# EAGLE design Overdrive (EAGLE 7.7.0)
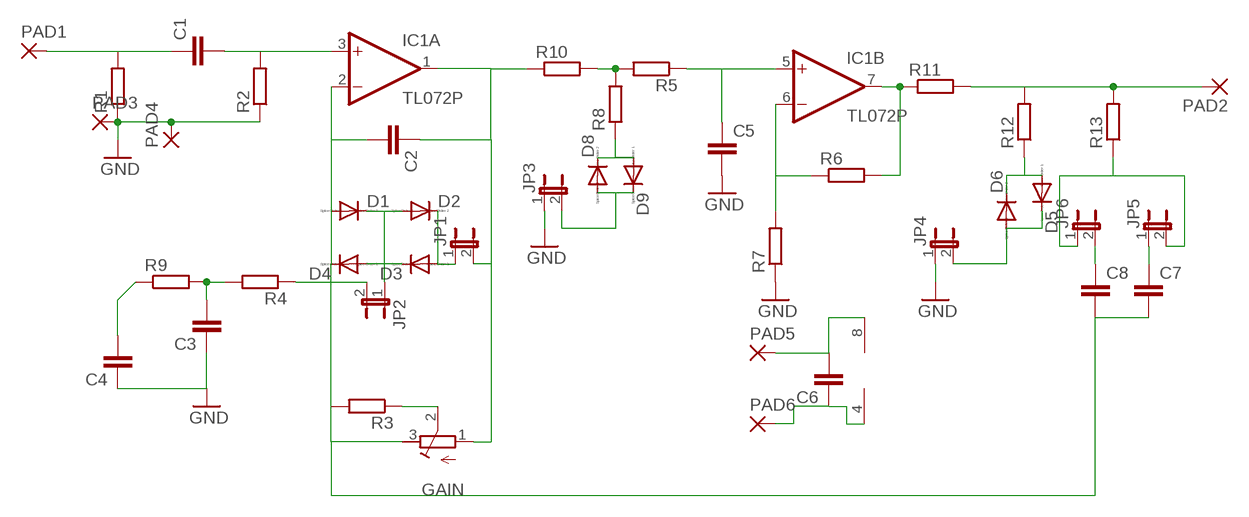
[diagram p0: schematic, sheet 1]

## Parts
C1  C-EU050-030X075  [C050-030X075]
C2  C-EU050-030X075  [C050-030X075]
C3  C-EU050-030X075  [C050-030X075]
C4  C-EU050-030X075  [C050-030X075]
C5  C-EU050-030X075  [C050-030X075]
C6  C-EU050-030X075  [C050-030X075]
C7  C-EU050-030X075  [C050-030X075]
C8  C-EU050-030X075  [C050-030X075]
D1  1N4148DO35-7  [DO35-7]
D2  1N4148DO35-7  [DO35-7]
D3  1N4148DO35-7  [DO35-7]
D4  1N4148DO35-7  [DO35-7]
D5  1N4148DO35-7  [DO35-7]
D6  1N4148DO35-7  [DO35-7]
D8  1N4148DO35-7  [DO35-7]
D9  1N4148DO35-7  [DO35-7]
GAIN  R-TRIMM64W  [RTRIM64W]
IC1  TL072P  [DIL08]
JP1  JP1E  [JP1]
JP2  JP1E  [JP1]
JP3  JP1E  [JP1]
JP4  JP1E  [JP1]
JP5  JP1E  [JP1]
JP6  JP1E  [JP1]
PAD1  WIREPAD2,54/0,8  [2,54/0,8]
PAD2  WIREPAD2,54/0,8  [2,54/0,8]
PAD3  WIREPAD2,54/0,8  [2,54/0,8]
PAD4  WIREPAD2,54/0,8  [2,54/0,8]
PAD5  WIREPAD2,54/0,8  [2,54/0,8]
PAD6  WIREPAD2,54/0,8  [2,54/0,8]
R1  R-EU_0207/7  [0207/7]
R2  R-EU_0207/7  [0207/7]
R3  R-EU_0207/7  [0207/7]
R4  R-EU_0207/7  [0207/7]
R5  R-EU_0207/7  [0207/7]
R6  R-EU_0207/7  [0207/7]
R7  R-EU_0207/7  [0207/7]
R8  R-EU_0207/7  [0207/7]
R9  R-EU_0207/7  [0207/7]
R10  R-EU_0207/7  [0207/7]
R11  R-EU_0207/7  [0207/7]
R12  R-EU_0207/7  [0207/7]
R13  R-EU_0207/7  [0207/7]

## Nets
GND: C3.1 C4.1 C5.2 JP3.1 JP4.1 PAD3.1(P) PAD4.1(P) R1.1 R2.1 R7.1
N$1: C1.1 PAD1.1(P) R1.2
N$2: C1.2 IC1.3(A:+IN) R2.2
N$3: C2.2 C7.2 C8.2 D1.A D4.C GAIN.3(E) IC1.2(A:-IN) JP2.2 R3.2 R4.1
N$4: C2.1 GAIN.1(A) IC1.1(A:OUT) JP1.2 R10.1
N$5: IC1.6(B:-IN) R6.1 R7.2
N$6: IC1.7(B:OUT) R6.2 R11.1
N$7: D1.C D2.A D3.C D4.A JP2.1
N$8: D8.A D9.C JP3.2
N$9: D2.C D3.A JP1.1
N$10: GAIN.2(S) R3.1
N$11: C6.2 IC1.8(P:V+) PAD5.1(P)
N$12: D8.C D9.A R8.1
N$13: C4.2 R9.1
N$14: C3.2 R4.2 R9.2
N$15: R5.2 R8.2 R10.2
N$16: C6.1 IC1.4(P:V-) PAD6.1(P)
N$17: C5.1 IC1.5(B:+IN) R5.1
N$18: PAD2.1(P) R11.2 R12.2 R13.2
N$19: D5.A D6.C R12.1
N$20: D5.C D6.A JP4.2
N$21: C8.1 JP6.2
N$22: JP5.2 JP6.1 R13.1
N$23: C7.1 JP5.1

## Library data of the parts
C1-C8 = rcl:C-EU: CAPACITOR, European symbol
D1-D6 D8 D9 = diode:1N4148: DIODE high speed (Philips)
GAIN = rcl:R-TRIMM: Trimm resistor
IC1 = linear:TL072: OP AMP
JP1-JP6 = jumper:JP1E: JUMPER
PAD1-PAD6 = wirepad:WIREPAD: Wire PAD connect wire on PCB
R1-R13 = rcl:R-EU_: RESISTOR, European symbol

## Board
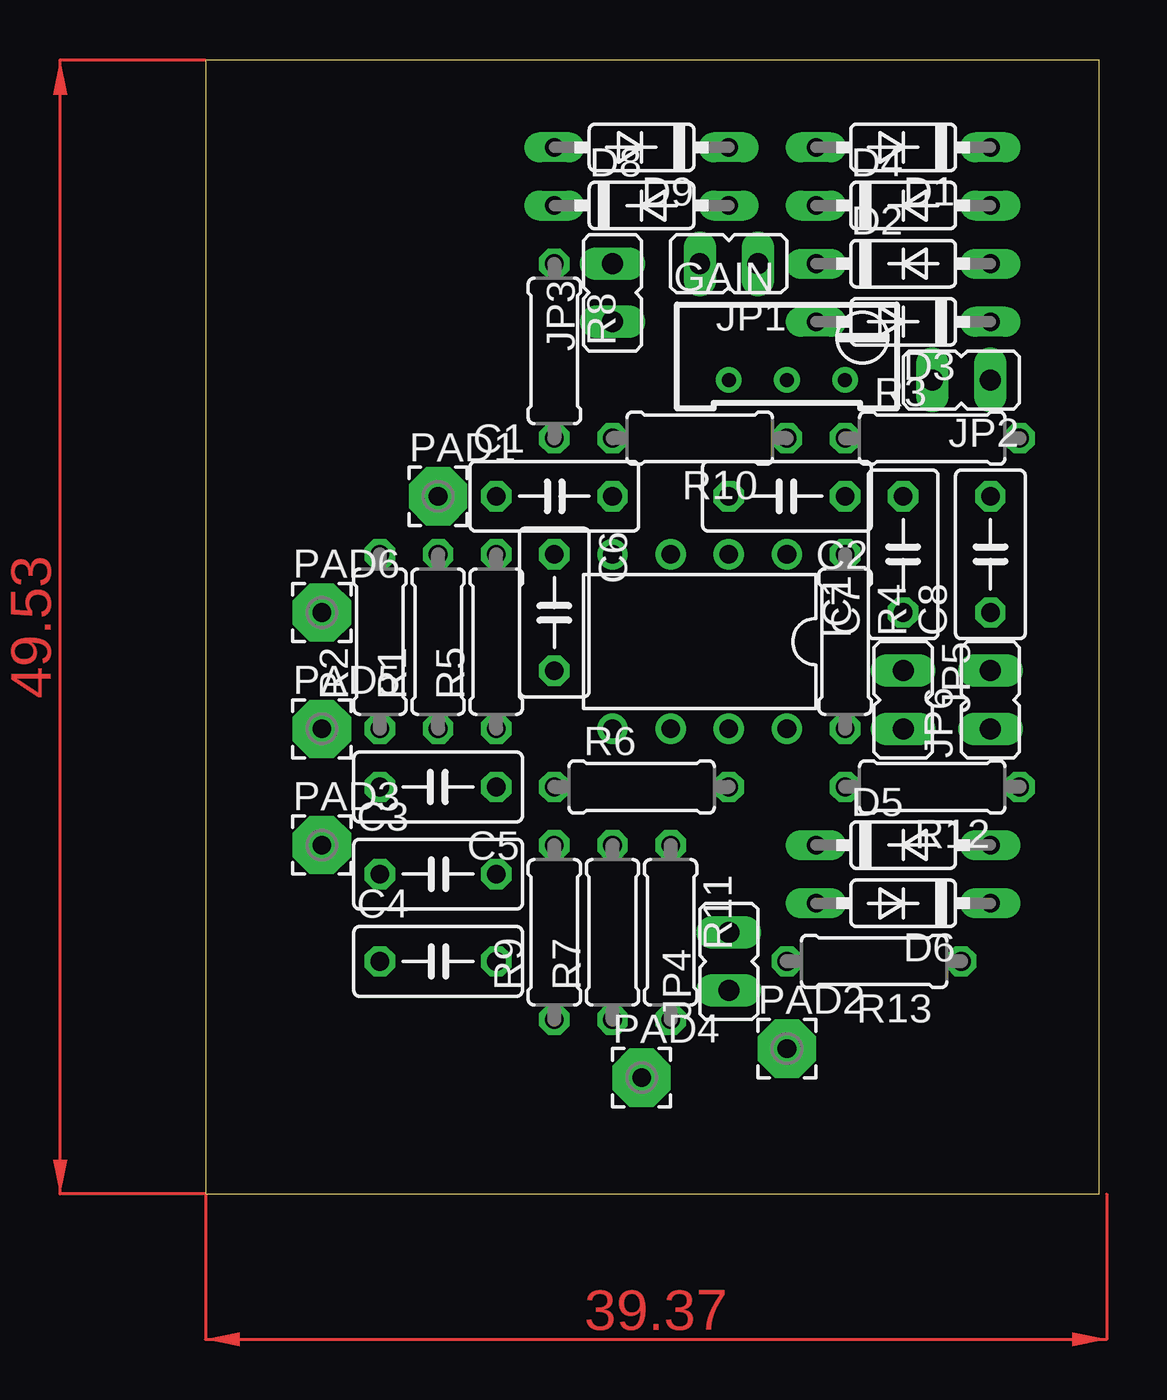
[diagram p1: board, top side]
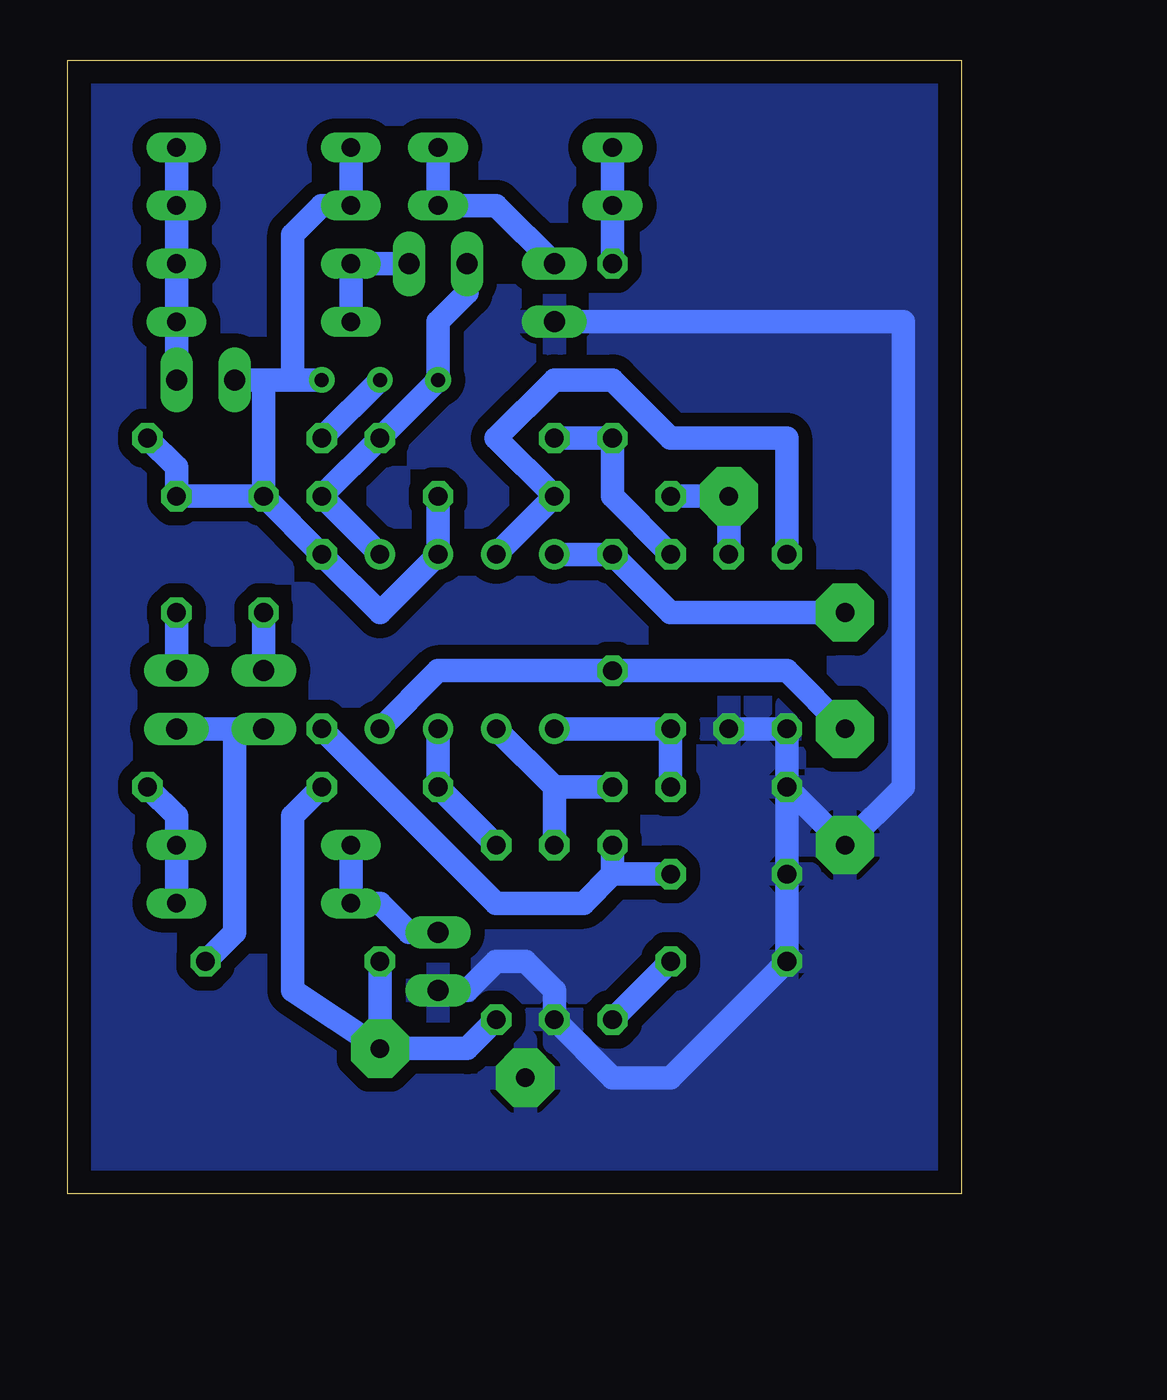
[diagram p2: board, bottom side, seen from below]

Size 39.04 x 49.52 mm. Coordinates in mm from the lower left corner, seen from the top.
Outline: 0,0 39.04,0 39.04,49.52 0,49.52 0,0
Copper layers (1*16): Top 0.035mm / dielectric 1.5mm / Bottom 0.035mm
Design rules "default": minimum track width 10mil, minimum drill 24mil, track to track 8mil, track to pad 8mil, pad to pad 8mil, via to via 8mil, smd to smd 8mil, copper to edge 40mil, drill to drill 8mil, minimum pad ring 10mil, minimum via ring 8mil, stop-mask expansion 4mil, vias tented up to drill 0mil, thermal gap 10mil

### Footprints (pad centres in the part's own frame; a part is rotated, then mirrored left to right if it is on the bottom)
C050-030X075 = drill 0.813 octagon: 1 -2.54,0; 2 2.54,0
DO35-7 = drill 0.813 long: A 3.81,0; C -3.81,0
RTRIM64W = drill 0.61: 1 1.27,-2.54; 2 1.27,0; 3 1.27,2.54
DIL08 = drill 0.813 pad 1.27: 1 -3.81,-3.81; 2 -1.27,-3.81; 3 1.27,-3.81; 4 3.81,-3.81; 5 3.81,3.81; 6 1.27,3.81; 7 -1.27,3.81; 8 -3.81,3.81
JP1 = drill 0.914 long: 1 0,-1.27; 2 0,1.27
2,54/0,8 = drill 0.813 pad 2.54 octagon: 1 0,0
0207/7 = drill 0.813 octagon: 1 -3.81,0; 2 3.81,0

### Placement (x,y rotation side)
C1  15.24,30.48 0 top
C2  25.4,30.48 180 top
C3  10.16,13.97 0 top
C4  10.16,10.16 0 top
C5  10.16,17.78 180 top
C6  15.24,25.4 270 top
C7  30.48,27.94 90 top
C8  34.29,27.94 90 top
D1  30.48,45.72 180 top
D2  30.48,40.64 0 top
D3  30.48,38.1 180 top
D4  30.48,43.18 0 top
D5  30.48,15.24 0 top
D6  30.48,12.7 180 top
D8  19.05,43.18 0 top
D9  19.05,45.72 180 top
GAIN  25.4,36.83 270 top
IC1  21.59,24.13 180 top
JP1  22.86,40.64 90 top
JP2  33.02,35.56 90 top
JP3  17.78,39.37 0 top
JP4  22.86,10.16 0 top
JP5  30.48,21.59 180 top
JP6  34.29,21.59 0 top
PAD1  10.16,30.48 0 top
PAD2  25.4,6.35 0 top
PAD3  5.08,15.24 0 top
PAD4  19.05,5.08 0 top
PAD5  5.08,20.32 0 top
PAD6  5.08,25.4 0 top
R1  10.16,24.13 90 top
R2  7.62,24.13 90 top
R3  31.75,33.02 0 top
R4  27.94,24.13 270 top
R5  12.7,24.13 90 top
R6  19.05,17.78 0 top
R7  17.78,11.43 90 top
R8  15.24,36.83 270 top
R9  15.24,11.43 90 top
R10  21.59,33.02 180 top
R11  20.32,11.43 270 top
R12  31.75,17.78 180 top
R13  29.21,10.16 180 top

### Tracks (layer width: path | path; a pad name or v marks a point on that pad's centre or on a via)
GND
  Bottom 1.016: R1.1 R2.1 C5.2 | C5.2 C3.1 C4.1 12.7,5.08 15.24,5.08 R7.1 17.78,8.89 19.05,10.16 20.32,10.16 21.59,8.89 JP4.1 | C5.2 PAD3.1 2.54,17.78 2.54,38.1 JP3.1
  pour Bottom (isolate 0.61): 0,0 39.37,0 39.37,49.53 0,49.53
N$1
  Bottom 1.016: C1.1 PAD1.1 R1.2
N$2
  Bottom 1.016: IC1.3 C1.2 20.32,33.02 17.78,35.56 15.24,35.56 12.7,33.02 7.62,33.02 R2.2
N$3
  Bottom 1.016: C2.2 IC1.2 25.4,25.4 R4.1 C7.2 | D1.A D4.C 27.94,43.18 29.21,41.91 29.21,35.56 GAIN.3 | R3.2 34.29,31.75 C8.2 C7.2 | C7.2 30.48,35.56 GAIN.3 | JP2.2 GAIN.3
N$4
  Bottom 1.016: IC1.1 C2.1 R10.1 GAIN.1 22.86,38.1 21.59,39.37 JP1.2
N$5
  Bottom 1.016: IC1.6 17.78,17.78 | 17.78,17.78 R6.1 | R7.2 17.78,17.78
N$6
  Bottom 1.016: IC1.7 R6.2 R11.1
N$7
  Bottom 1.016: D1.C D4.A D2.A D3.C JP2.1
N$8
  Bottom 1.016: D9.C D8.A 20.32,43.18 JP3.2
N$9
  Bottom 1.016: D3.A D2.C JP1.1
N$10
  Bottom 1.016: GAIN.2 R3.1
N$11
  Bottom 1.016: PAD5.1 7.62,22.86 C6.2 22.86,22.86 IC1.8
N$12
  Bottom 1.016: R8.1 D8.C D9.A
N$13
  Bottom 1.016: R9.1 C4.2
N$14
  Bottom 1.016: R4.2 20.32,12.7 16.51,12.7 15.24,13.97 | R9.2 15.24,13.97 | 15.24,13.97 C3.2
N$15
  Bottom 1.016: R5.2 15.24,30.48 R8.2 R10.2
N$16
  Bottom 1.016: IC1.4 C6.1 12.7,25.4 PAD6.1
N$17
  Bottom 1.016: IC1.5 R5.1 C5.1
N$18
  Bottom 1.016: R12.2 29.21,16.51 29.21,8.89 PAD2.1 | R11.2 21.59,6.35 PAD2.1 | R13.2 PAD2.1
N$19
  Bottom 1.016: D6.C D5.A 34.29,16.51 R12.1
N$20
  Bottom 1.016: D5.C D6.A 25.4,12.7 24.13,11.43 JP4.2
N$21
  Bottom 1.016: C8.1 JP6.2
N$22
  Bottom 1.016: JP6.1 JP5.2 31.75,20.32 31.75,11.43 R13.1
N$23
  Bottom 1.016: C7.1 JP5.1
(copper drawn outside any net)
  shapes: Top area x2